# Altium schematic sheet CP2104SCH.SchDoc
size A4; SheetNumber: 1; SheetTotal: 1
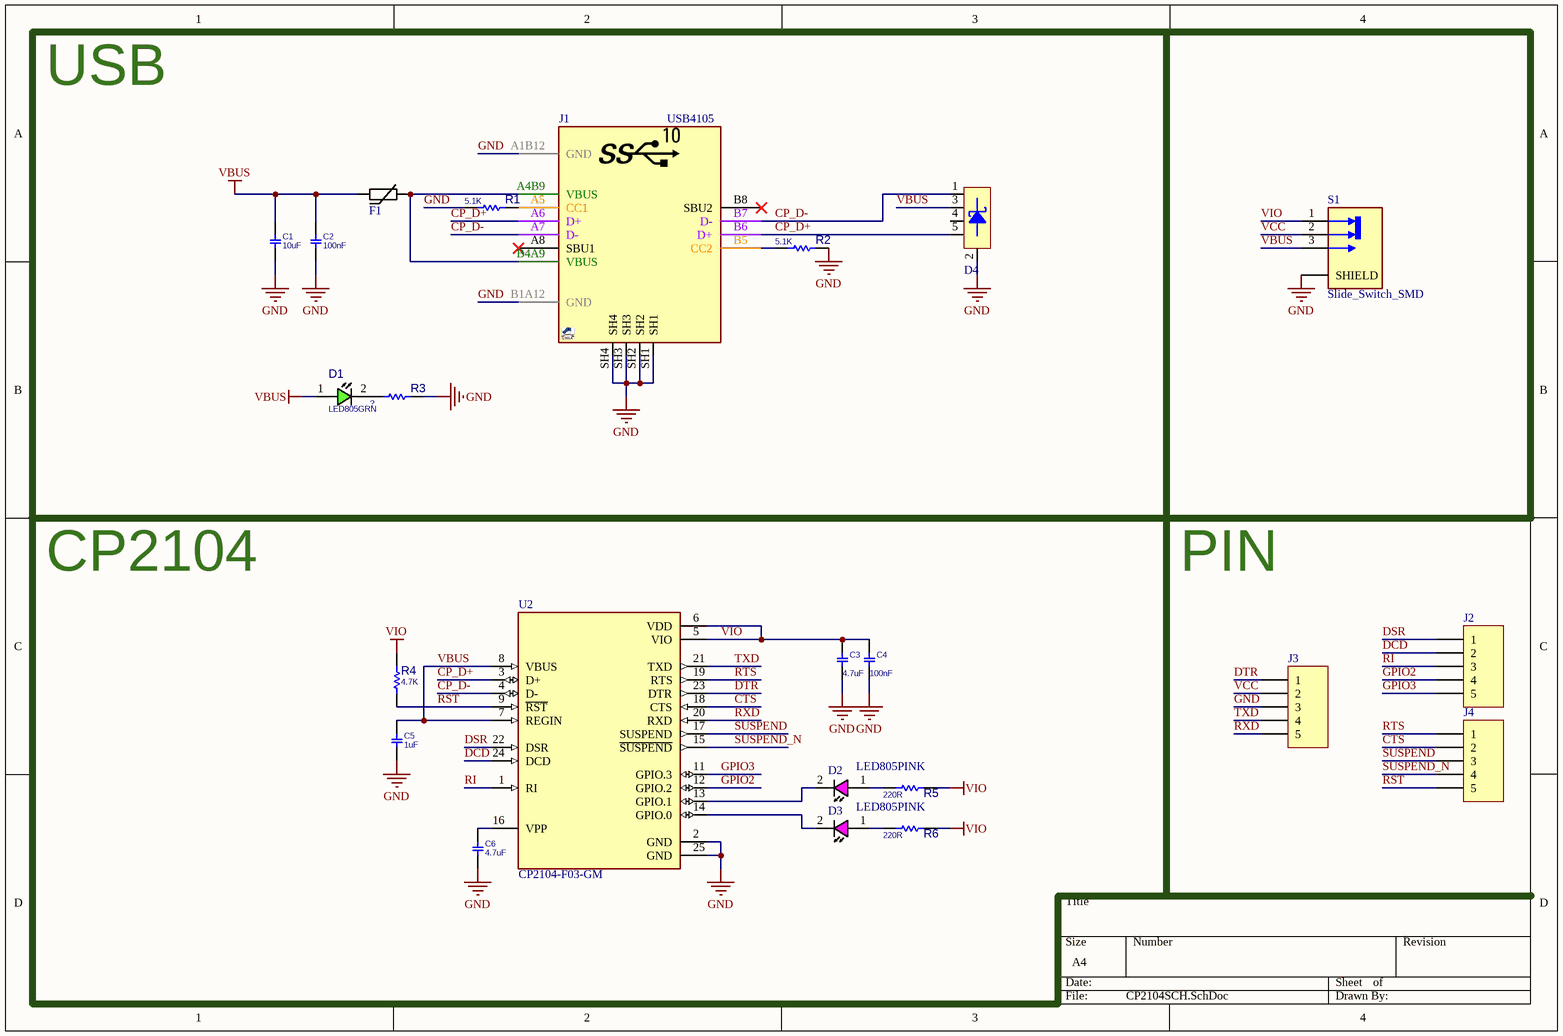
[diagram p0: CP2104SCH.SchDoc]

## Parts
C1  10uF  [C0603]
C2  100nF  [C0603]
C3  4.7uF  [C0603]
C4  100nF  [C0603]
C5  1uF  [C0603]
C6  4.7uF  [C0603]
D1  LED805GRN  [LED0805GRN]
D2  LED805PINK  [LED_Pink_0805]
D3  LED805PINK  [LED_Pink_0805]
D4  SMF-05  [SC70-5_N]  (value not drawn)
F1  6V-0.5A  [FUSE0603 (1608)]  (value not drawn)
J1  USB4105  [USBC_SMD_16_USB4105]
J2  5  [HDR_THT_5M_2.54mm]  (value not drawn)
J3  5  [HDR_THT_5M_2.54mm_RA]  (value not drawn)
J4  5  [HDR_THT_5M_2.54mm]  (value not drawn)
R1  5.1K  [R0603]
R2  5.1K  [R0603]
R3  ?  [R0603]
R4  4.7K  [R0603]
R5  220R  [R0603]
R6  220R  [R0603]
S1  Slide_Switch_SMD  [Slide_Switch_SMD]
U2  CP2104-F03-GM  [CP2104-F03-GM]

## Blocks framed on the sheet
USB: C1 C2 D1 D4 F1 J1 R1-R3 S1

## Nets
GND: C1.1 C2.1 C3.1 C4.1 C5.1 C6.1 D4.2(K) J1.A1B12(GND) J1.B1A12(GND) J1.SH1 J1.SH2 J1.SH3 J1.SH4 J3.3 R1.1 R2.2 R3.1 S1.4(SHIELD) U2.2(GND) U2.25(GND)
VBUS: C1.2 C2.2 C5.2 D1.1(ANODE) D4.3(K) F1.1 S1.3 U2.7(REGIN) U2.8(VBUS)
VIO: C3.2 C4.2 R4.2 R5.1 R6.1 S1.1 U2.5(VIO) U2.6(VDD)
CP_D+: D4.5(K) J1.A6(D+) J1.B6(D+) U2.3(D+)
CP_D-: D4.1(K) J1.A7(D-) J1.B7(D-) U2.4(D-)
CTS: J4.2 U2.18(CTS)
DCD: J2.2 U2.24(DCD)
DSR: J2.1 U2.22(DSR)
DTR: J3.1 U2.23(DTR)
GPIO2: J2.4 U2.12(GPIO.2)
GPIO3: J2.5 U2.11(GPIO.3)
RI: J2.3 U2.1(RI)
RST: J4.5 R4.1 U2.9(~{RST})
RTS: J4.1 U2.19(RTS)
RXD: J3.5 U2.20(RXD)
SUSPEND: J4.3 U2.17(SUSPEND)
SUSPEND_N: J4.4 U2.15(~{SUSPEND})
TXD: J3.4 U2.21(TXD)
VCC: J3.2 S1.2
NetC6_2: C6.2 U2.16(VPP)
NetD1_2: D1.2(CATHODE) R3.2
NetD2_1: D2.1(ANODE) R5.2
NetD2_2: D2.2(CATHODE) U2.13(GPIO.1)
NetD3_1: D3.1(ANODE) R6.2
NetD3_2: D3.2(CATHODE) U2.14(GPIO.0)
NetF1_2: F1.2 J1.A4B9(VBUS) J1.B4A9(VBUS)
NetJ1_A5: J1.A5(CC1) R1.2
NetJ1_B5: J1.B5(CC2) R2.1

Not connected (* = marked no-connect by the designer): D4 4(K); J1 A8(SBU1)* B8(SBU2)*

## Notes on the sheet
- CP2104
- PIN

## Library data of the parts
C1-C6 = CAP_SMD_MLCC_0603: CAP, MLCC, -F, -V, MATERIAL, -%, 0201; PARAM: -, -%; MANF_P#: MANF_PART#; PRICE: 100= 1$; MANF: -; PARAM2: -V; ASSEMBLY: ASSEMBLY
  C1: VALUE: 10uF
  C2 C4: VALUE: 100nF
  C3 C6: VALUE: 4.7uF
  C5: VALUE: 1uF
D1 = LED_SMD_0805_GRN: LED, SMD, 0805, GREEN; PARAM: 20mA; DESC: DESCRIPTION; PARAM2: 2.2V; MANF: -; ASSEMBLY: ASSEMBLY; PRICE: 36t@Javan; MANF_P#: -; VALUE: LED805GRN
D2 D3 = LED_Pink: LED, SMD, 0805, PINK
D4 = Semi_Diod_TVS_SMF05: TVS Diode Array; Rating: Rating?; Validation: Valid; Inflow: inflow?; Type: TVS; Value: SMF-05; Package: SC70-5
F1 = PPTC Resettable Fuses: Value: 6V-0.5A; Publisher: Majid Derhambakhsh
J1 = CONN_USBC_SMD_16_USB4105: CONN, USB, Type C, USB 2.0, Right-Angle, SMD; MANF: GCT; MANF_P#: USB4105-GF-A; PARAM: 5A; Price: 1.5$; Value: USB4105
J2-J4 = Con_MPH_5x1_V_THT_2.54: Header, single row, 5 pin; Rating: Rating?; Inflow: 7152; Validation: NT; Value: 5; Package: Package?; Type: Type?
R1-R6 = RES_SMD_0603: RESISTOR, SMD; PARAM: -W; DESC: DESCRIPTION; DIST#: MOUSER; PARAM2: 1%; MANF_P#: -; MANF: -; ASSEMBLY: ASSEMBLY; PRICE: 100= 0.5$
  R1 R2: VALUE: 5.1K
  R3: VALUE: ?
  R4: VALUE: 4.7K
  R5 R6: VALUE: 220R
U2 = CP2104-F03-GM: USB Bridge, USB to UART USB 2.0 UART Interface 24-QFN _4x4_